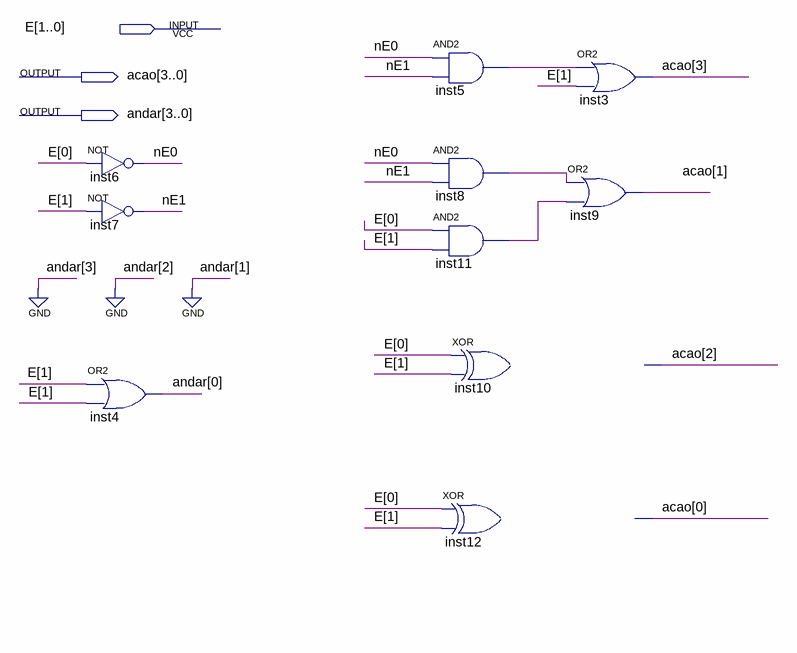
[diagram p0: schematic sheet]
// Quartus schematic logicaSaida.bdf as structural Verilog: 10 symbols, 3 pins
module logicaSaida (
  input  [1:0] E,
  output [3:0] acao,
  output [3:0] andar
);

  wire inst5_out, inst8_out, inst11_out, nE0, nE1;

  not inst6 (nE0, E[0]);
  not inst7 (nE1, E[1]);
  or inst4 (andar[0], E[1], E[1]);
  and inst5 (inst5_out, nE0, nE1);
  and inst8 (inst8_out, nE0, nE1);
  and inst11 (inst11_out, E[0], E[1]);
  xor inst10 (acao[2], E[0], E[1]);
  xor inst12 (acao[0], E[0], E[1]);
  or inst3 (acao[3], inst5_out, E[1]);
  or inst9 (acao[1], inst8_out, inst11_out);

  assign andar[3:1] = 3'b000;
endmodule
